# Altium project p1.PrjPcb
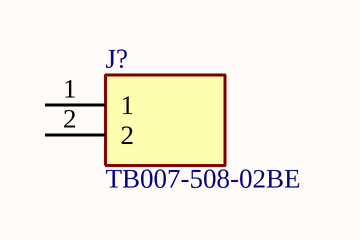
[diagram p0: Sheet1.SchDoc]
1 sheet, 1 parts. Net scope: global (net labels, ports and power ports of the same name join across sheets).
Board file: PCB1.PcbDoc

## Sheet Sheet1.SchDoc: Project 1
size A4; DocumentNumber: jkfkj; Revision: mm; SheetNumber: 1; SheetTotal: 1

### Parts
J?  TB007-508-02BE  [CUI_TB007-508-02BE]

### Nets

Not connected (* = marked no-connect by the designer): J? 1 2

### Library data of the parts
J? = TB007-508-02BE: 2~24 Poles, Screw Type, Horizontal, 5.08 Pitch, 24~12 (AWG), Terminal Block Connector; MF: Same Sky; SnapEDA_Link: https://www.snapeda.com/parts/TB007-508-02BE/Same+Sky/view-part/?ref=snap; Package: None; Value: *; MP: TB007-508-02BE; Check_prices: https://www.snapeda.com/parts/TB007-508-02BE/Same+Sky/view-part/?ref=eda